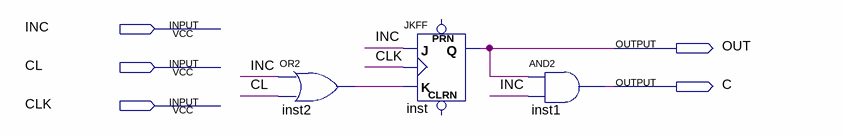
[diagram p0: schematic sheet]
// Quartus schematic Register.bdf as structural Verilog: 3 symbols, 5 pins
module Register (
  input  INC,
  input  CL,
  input  CLK,
  output OUT,
  output C
);

  wire inst2_out;

  or inst2 (inst2_out, INC, CL);
  JKFF inst (.K(inst2_out), .J(INC), .CLK(CLK), .Q(OUT));  // open: PRN, CLRN
  and inst1 (C, OUT, INC);
endmodule
